# EAGLE schematic fan_controller (EAGLE 7.3.0)
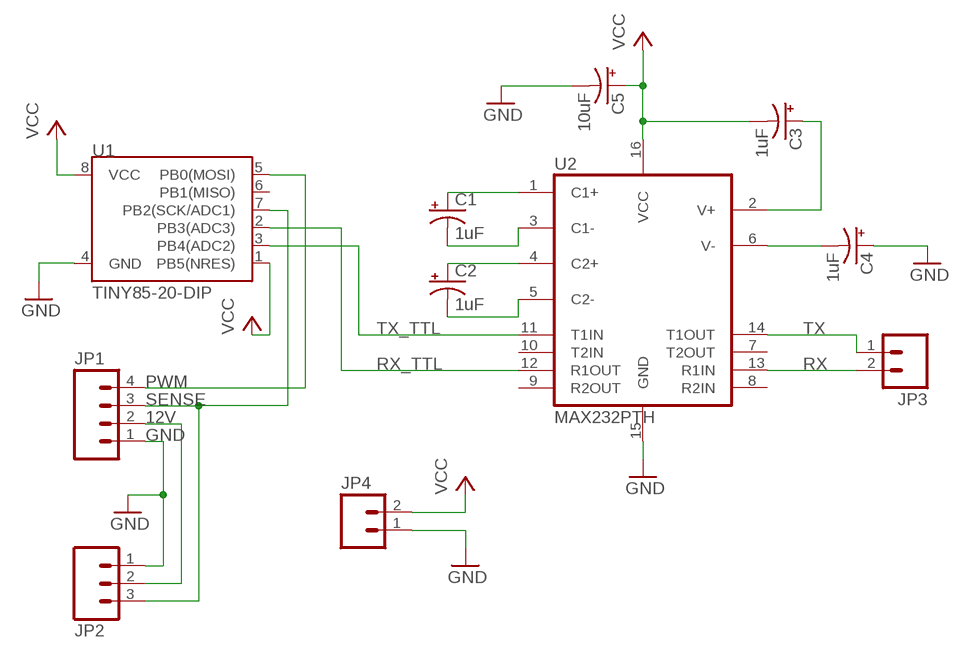
[diagram p0: schematic, sheet 1]

## Parts
C1  1uF  CAP_POLPTH2  [CPOL-RADIAL-10UF-25V]
C2  1uF  CAP_POLPTH2  [CPOL-RADIAL-10UF-25V]
C3  1uF  CAP_POLPTH2  [CPOL-RADIAL-10UF-25V]
C4  1uF  CAP_POLPTH2  [CPOL-RADIAL-10UF-25V]
C5  10uF  CAP_POLPTH2  [CPOL-RADIAL-10UF-25V]
JP1  M04PTH  [1X04]
JP2  M03PTH  [1X03]
JP3  M02PTH  [1X02]
JP4  M02PTH  [1X02]
U1  TINY85-20-DIP  ATTINY45TINY85-20-DIP  [DIP08]
U2  MAX232PTH  [DIL16]

## Nets
12V: JP1.2 JP2.2
GND: C4.1(+) C5.2(-) JP1.1 JP2.1 JP4.1 U1.4(GND) U2.15(GND)
N$1: C1.1(+) U2.1(C1+)
N$2: C1.2(-) U2.3(C1-)
N$3: C2.1(+) U2.4(C2+)
N$4: C2.2(-) U2.5(C2-)
N$6: C3.1(+) U2.2(V+)
N$7: C4.2(-) U2.6(V-)
PWM: JP1.4 U1.5(PB0(MOSI))
RX: JP3.2 U2.13(R1IN)
RX_TTL: U1.2(PB3(ADC3)) U2.12(R1OUT)
SENSE: JP1.3 JP2.3 U1.7(PB2(SCK/ADC1))
TX: JP3.1 U2.14(T1OUT)
TX_TTL: U1.3(PB4(ADC2)) U2.11(T1IN)
VCC: C3.2(-) C5.1(+) JP4.2 U1.1(PB5(NRES)) U1.8(VCC) U2.16(VCC)
Unconnected: U1.6(PB1(MISO)) U2.7(T2OUT) U2.8(R2IN) U2.9(R2OUT) U2.10(T2IN)

## Library data of the parts
C1-C5 = SparkFun-Passives:CAP_POL: Capacitor Polarized These are standard SMD and PTH capacitors. Normally 10uF, 47uF, and 100uF in electrolytic and tantalum varieties. Always verify the external diameter of the through hole cap, it varies with capacity, voltage, and manufacturer. The EIA devices should be standard.
JP1 = SparkFun-Connectors:M04: Header 4 Standard 4-pin 0.1" header. Use with straight break away headers (SKU : PRT-00116), right angle break away headers (PRT-00553), swiss pins (PRT-00743), machine pins (PRT-00117), and female headers (PRT-00115). Molex polarized connector foot print use with SKU : PRT-08231 with associated crimp pins and housings. 1MM SMD Version SKU: PRT-10208
JP2 = SparkFun-Connectors:M03: Header 3 Standard 3-pin 0.1" header. Use with straight break away headers (SKU : PRT-00116), right angle break away headers (PRT-00553), swiss pins (PRT-00743), machine pins (PRT-00117), and female headers (PRT-00115). Molex polarized connector foot print use with SKU : PRT-08232 with associated crimp pins and housings.
JP3 JP4 = SparkFun-Connectors:M02: Standard 2-pin 0.1" header. Use with - straight break away headers ( PRT-00116) - right angle break away headers (PRT-00553) - swiss pins (PRT-00743) - machine pins (PRT-00117) - female headers (PRT-00115) Molex polarized connector foot print use with: PRT-08233 with associated crimp pins and housings. 2.54_SCREWTERM for use with PRT-10571. 3.5mm Screw Terminal footprints for PRT-08084 5mm Screw Terminal footprints for use with PRT-08432
U1 = SparkFun-DigitalIC:ATTINY45: Atmel 8-pin 2/4/8kB flash uC; PROD_ID: IC-09445
U2 = SparkFun-DigitalIC:MAX232: RS232 Transceiver Very common IC. This is generically called 'MAX232', but works with the 3V equivalent MAX3232 generic ICs. Field tested and mother approved. Spark Fun Electronics SKU : COM-00316 (DIP) and COM-00589 (SMD)

## Net classes
0 default: width 0.762 mm, drill 0.508 mm, clearance 0.508 mm